# EAGLE design MethaneFlux (EAGLE 9.6.2)

## Sheet 1 of 2: Board 1- Power Module, Arduino MRK NB 1500, Methane Sensors (2600 2602 2611)
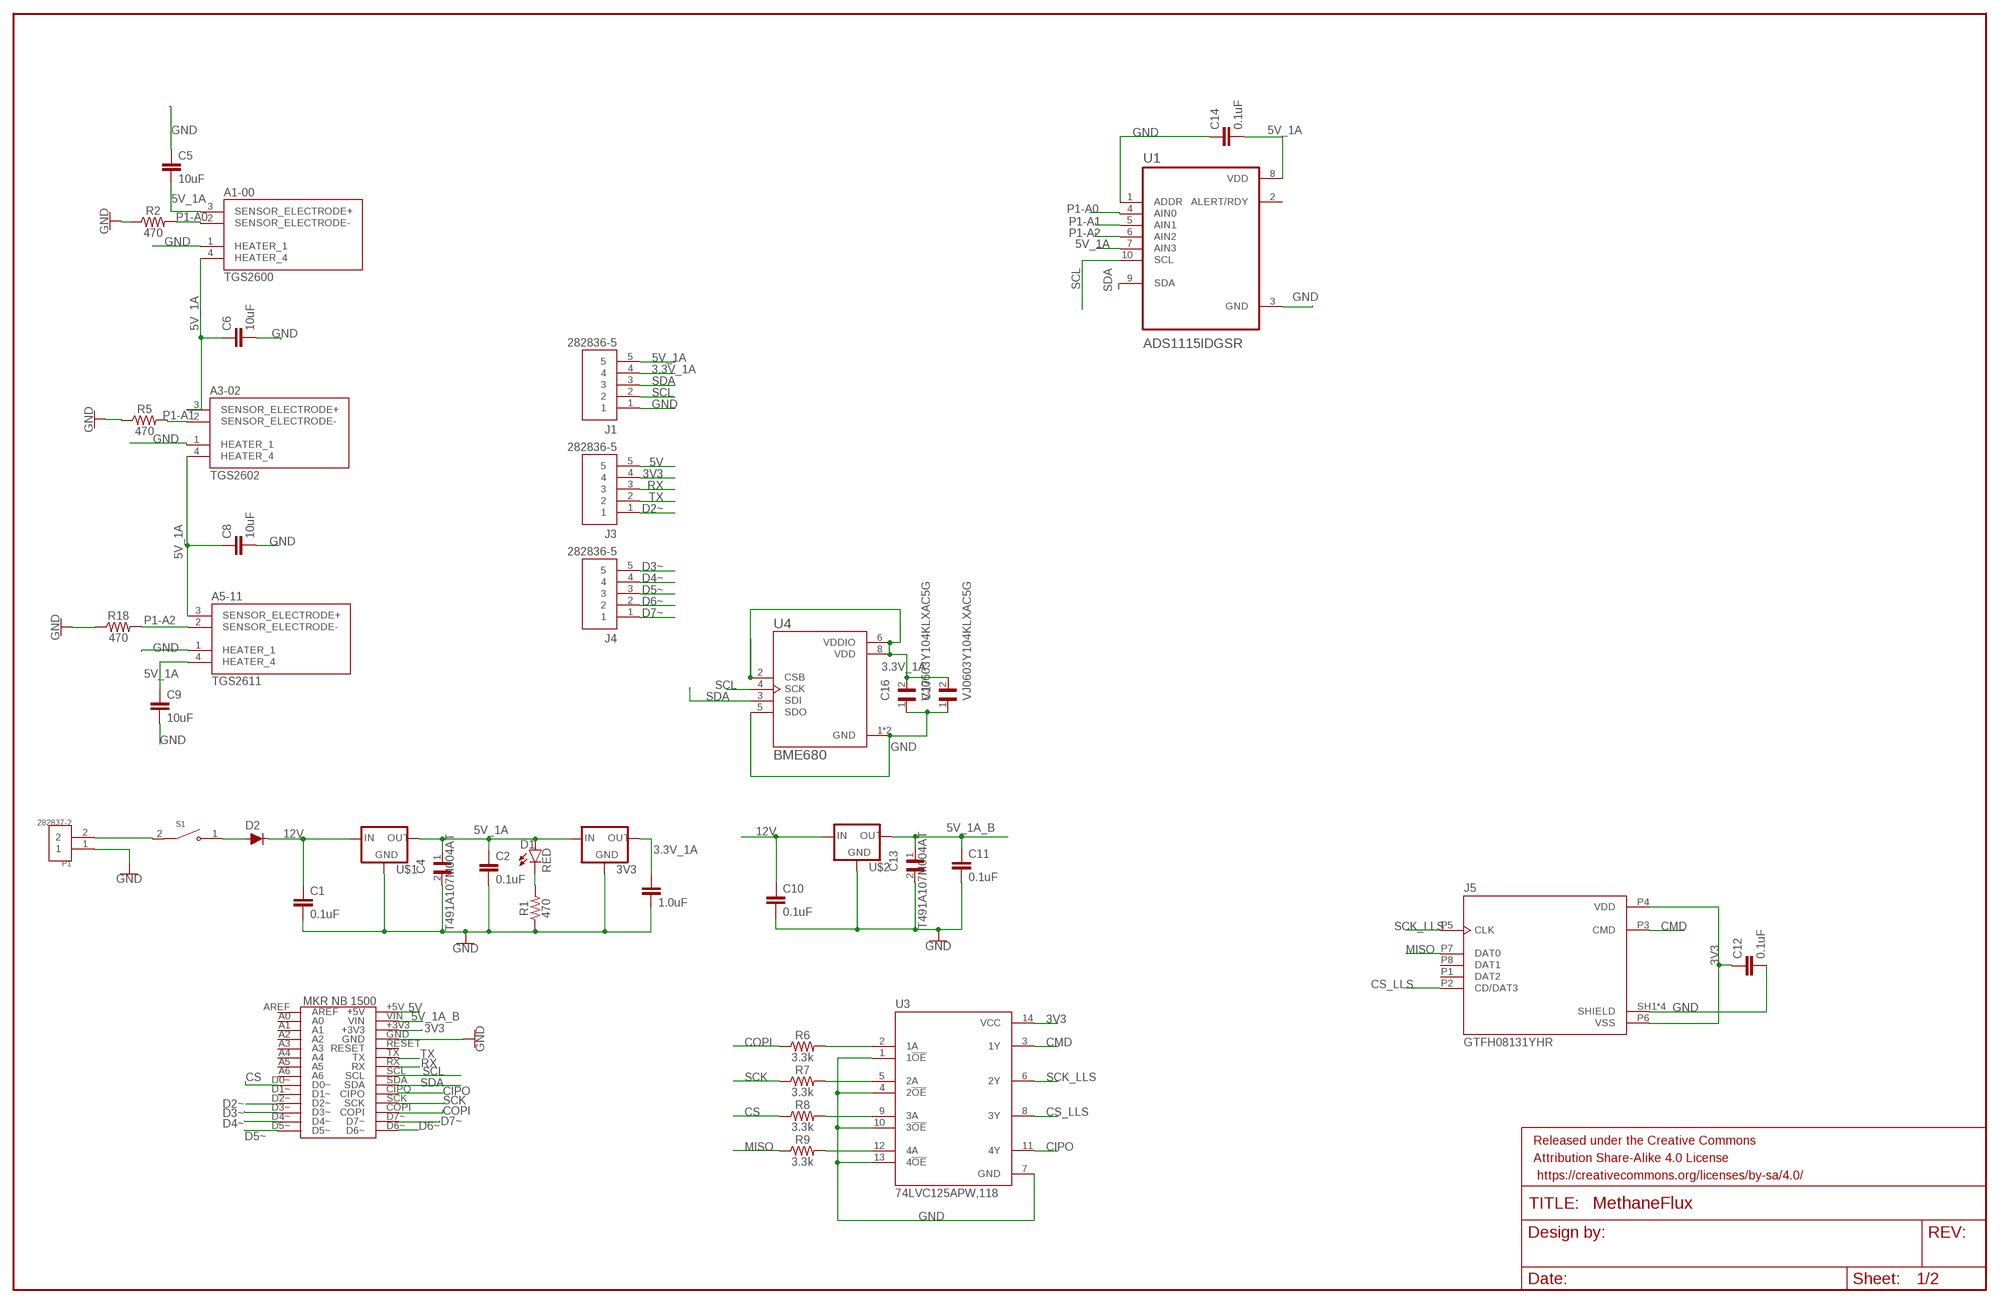
[diagram p0: schematic, sheet 1]

### Parts
3V3  V_REG_LD1117VXXLD1117-SMD  [SOT223]
A1-00  TGS2600  [TO255P920H830-4]
A3-02  TGS2602  [TGS2602]
A5-11  TGS2611  [TGS2611]
C1  0.1uF  0.1UF-0603-25V-5%  [0603]
C2  0.1uF  0.1UF-0603-25V-5%  [0603]
C3  1.0uF  1.0UF-0603-16V-10%  [0603]
C4  T491A107M004AT  [CAPC3216X110N]
C5  10uF  10UF-0603-6.3V-20%  [0603]
C6  10uF  10UF-0603-6.3V-20%  [0603]
C8  10uF  10UF-0603-6.3V-20%  [0603]
C9  10uF  10UF-0603-6.3V-20%  [0603]
C10  0.1uF  0.1UF-0603-25V-5%  [0603]
C11  0.1uF  0.1UF-0603-25V-5%  [0603]
C12  0.1uF  0.1UF-0603-25V-5%  [0603]
C13  T491A107M004AT  [CAPC3216X110N]
C14  0.1uF  0.1UF-0603-25V-5%  [0603]
C16  VJ0603Y104KLXAC5G  [CAPC1608X92N]
C17  VJ0603Y104KLXAC5G  [CAPC1608X92N]
D1  RED  LED-RED0603  [LED-0603]
D2  200mA/100V/1V  DIODE-1N4148  [DIODE-1N4148]
FRAME1  FRAME-LEDGER  [CREATIVE_COMMONS]
J1  282836-5  [TE_282836-5]
J3  282836-5  [TE_282836-5]
J4  282836-5  [TE_282836-5]
J5  GTFH08131YHR  [AMPHENOL_GTFH08131YHR]
P1  282837-2  [TE_282837-2]
R1  470  470OHM-0603-1/10W-1%  [0603]
R2  470  470OHM-0603-1/10W-1%  [0603]
R5  470  470OHM-0603-1/10W-1%  [0603]
R6  3.3k  3.3KOHM-0603-1/10W-1%  [0603]
R7  3.3k  3.3KOHM-0603-1/10W-1%  [0603]
R8  3.3k  3.3KOHM-0603-1/10W-1%  [0603]
R9  3.3k  3.3KOHM-0603-1/10W-1%  [0603]
R18  470  470OHM-0603-1/10W-1%  [0603]
S1  RB141C1100  [SW_RB141C1100]
U1  ADS1115IDGSR  [SOP50P490X110-10N]
U3  74LVC125APW,118  [IC_74LVC125APW,118]
U4  BME680  [PSON80P300X300X100-8N]
U$1  V_REG_LD1117VXXLD1117-SMD  [SOT223]
U$2  V_REG_LD1117VXXLD1117-SMD  [SOT223]
U$5  MKRNB1500  [MRKNB1500]

### Nets
3.3V_1A [5$3v3_1A]: 3V3.2(OUT) C3.1 C16.2 C17.2 J1.4 U4.2(CSB) U4.6(VDDIO) U4.8(VDD)
3V3: C12.1 J3.4 J5.P4(VDD) J5.P6(VSS) U3.14(VCC) U$5.+3V3
5V: J3.5 U$5.+5V
5V_1A [5$3v3_1A]: 3V3.3(IN) A1-00.3(SENSOR_ELECTRODE+) A1-00.4(HEATER_4) A3-02.3(SENSOR_ELECTRODE+) A3-02.4(HEATER_4) A5-11.3(SENSOR_ELECTRODE+) A5-11.4(HEATER_4) C2.1 C4.1 C5.2 C6.1 C8.1 C9.1 C14.2 D1.A J1.5 U1.7(AIN3) U1.8(VDD) U$1.2(OUT)
5V_1A_B [5$3v3_1A]: C11.1 C13.1 U$2.2(OUT) U$5.VIN
12V [PowerIn]: C1.1 C10.1 D2.C U$1.3(IN) U$2.3(IN)
CIPO: U3.11(4Y) U$5.CIPO
CMD: J5.P3(CMD) U3.3(1Y)
COPI: R6.1 U$5.COPI
CS: R8.1 U$5.D0~
CS_LLS: J5.P2(CD/DAT3) U3.8(3Y)
D2~: J3.1 U$5.D2~
D3~: J4.5 U$5.D3~
D4~: J4.4 U$5.D4~
D5~: J4.3 U$5.D5~
D6~: J4.2 U$5.D6~
D7~: J4.1 U$5.D7~
GND [GND]: 3V3.1(GND) A1-00.1(HEATER_1) A3-02.1(HEATER_1) A5-11.1(HEATER_1) C1.2 C2.2 C3.2 C4.2 C5.1 C6.2 C8.2 C9.2 C10.2 C11.2 C12.2 C13.2 C14.1 C16.1 C17.1 J1.1 J5.SH1(SHIELD) J5.SH2(SHIELD) J5.SH3(SHIELD) J5.SH4(SHIELD) P1.1 R1.1 R2.1 R5.1 R18.1 U1.1(ADDR) U1.3(GND) U3.1(1!OE) U3.4(2!OE) U3.7(GND) U3.10(3!OE) U3.13(4!OE) U4.1(GND) U4.5(SDO) U4.7(GND) U$1.1(GND) U$2.1(GND) U$5.GND
MISO: J5.P7(DAT0) R9.1
N$1: R6.2 U3.2(1A)
N$2 [PowerIn]: D1.C R1.2
N$3: R7.2 U3.5(2A)
N$4 [PowerIn]: P1.2 S1.2
N$5: D2.A S1.1
N$6: R8.2 U3.9(3A)
N$7: R9.2 U3.12(4A)
P1-A0 [ADC]: A1-00.2(SENSOR_ELECTRODE-) R2.2 U1.4(AIN0)
P1-A1 [ADC]: A3-02.2(SENSOR_ELECTRODE-) R5.2 U1.5(AIN1)
P1-A2 [ADC]: A5-11.2(SENSOR_ELECTRODE-) R18.2 U1.6(AIN2)
RX: J3.3 U$5.RX
SCK: R7.1 U$5.SCK
SCK_LLS: J5.P5(CLK) U3.6(2Y)
SCL: J1.2 U1.10(SCL) U4.4(SCK) U$5.SCL
SDA: J1.3 U1.9(SDA) U4.3(SDI) U$5.SDA
TX: J3.2 U$5.TX
Unconnected: J5.P1(DAT2) J5.P8(DAT1) U1.2(ALERT/RDY) U$5.A0 U$5.A1 U$5.A2 U$5.A3 U$5.A4 U$5.A5 U$5.A6 U$5.AREF U$5.D1~ U$5.RESET

## Sheet 2 of 2: Breakoff part to board 1- Methane Sensors (2600 2602 2611) and the ADC & BME
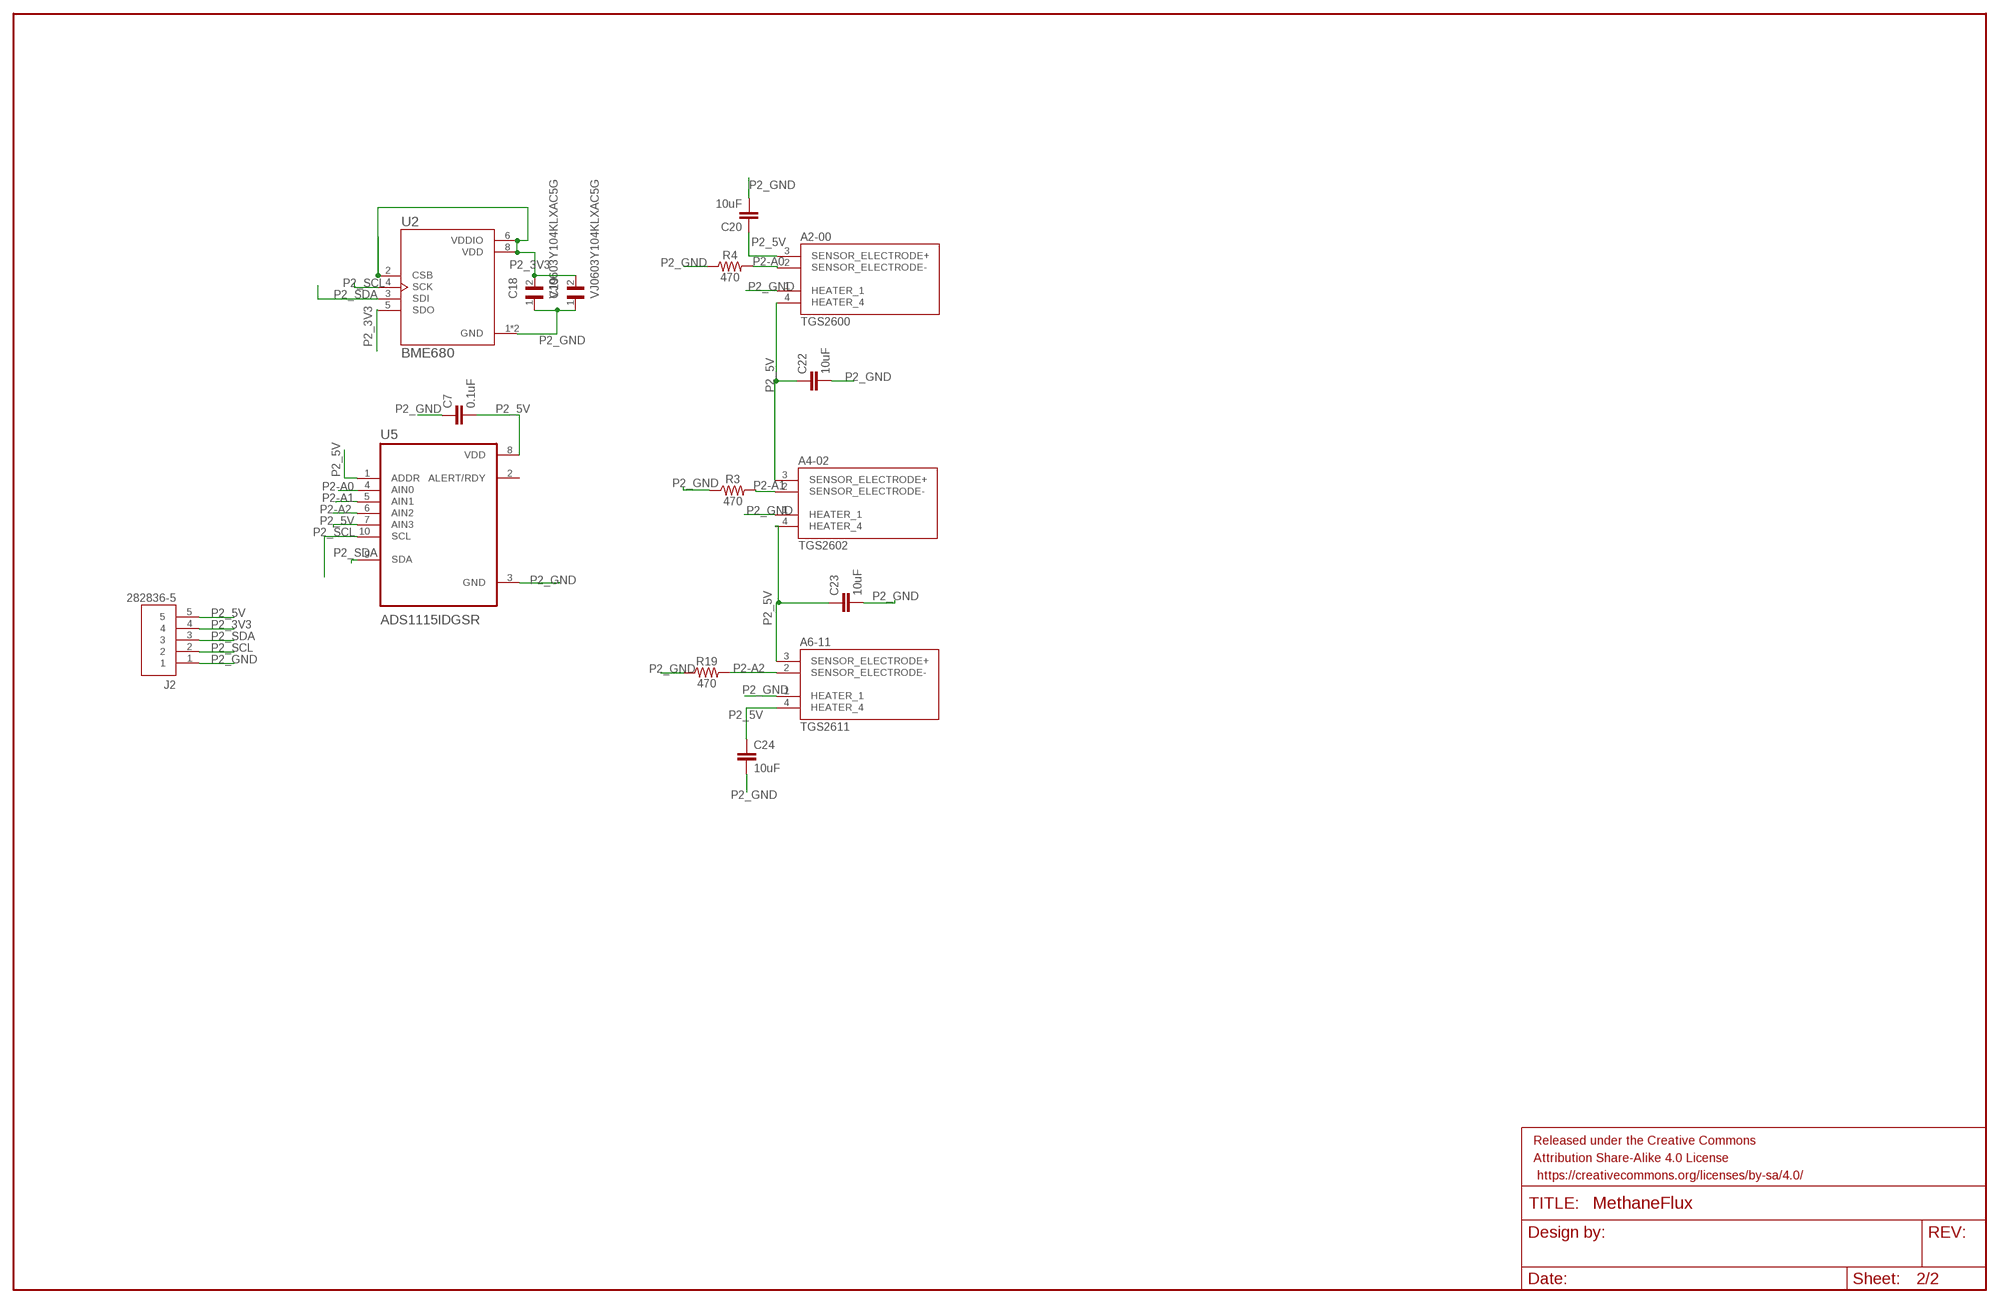
[diagram p1: schematic, sheet 2]

### Parts
A2-00  TGS2600  [TO255P920H830-4]
A4-02  TGS2602  [TGS2602]
A6-11  TGS2611  [TGS2611]
C7  0.1uF  0.1UF-0603-25V-5%  [0603]
C18  VJ0603Y104KLXAC5G  [CAPC1608X92N]
C19  VJ0603Y104KLXAC5G  [CAPC1608X92N]
C20  10uF  10UF-0603-6.3V-20%  [0603]
C22  10uF  10UF-0603-6.3V-20%  [0603]
C23  10uF  10UF-0603-6.3V-20%  [0603]
C24  10uF  10UF-0603-6.3V-20%  [0603]
FRAME2  FRAME-LEDGER  [CREATIVE_COMMONS]
J2  282836-5  [TE_282836-5]
R3  470  470OHM-0603-1/10W-1%  [0603]
R4  470  470OHM-0603-1/10W-1%  [0603]
R19  470  470OHM-0603-1/10W-1%  [0603]
U2  BME680  [PSON80P300X300X100-8N]
U5  ADS1115IDGSR  [SOP50P490X110-10N]

### Nets
P2-A0 [ADC]: A2-00.2(SENSOR_ELECTRODE-) R4.2 U5.4(AIN0)
P2-A1 [ADC]: A4-02.2(SENSOR_ELECTRODE-) R3.2 U5.5(AIN1)
P2-A2 [ADC]: A6-11.2(SENSOR_ELECTRODE-) R19.2 U5.6(AIN2)
P2_3V3 [5$3v3_1A]: C18.2 C19.2 J2.4 U2.2(CSB) U2.5(SDO) U2.6(VDDIO) U2.8(VDD)
P2_5V [5$3v3_1A]: A2-00.3(SENSOR_ELECTRODE+) A2-00.4(HEATER_4) A4-02.3(SENSOR_ELECTRODE+) A4-02.4(HEATER_4) A6-11.3(SENSOR_ELECTRODE+) A6-11.4(HEATER_4) C7.2 C20.1 C22.1 C23.1 C24.1 J2.5 U5.1(ADDR) U5.7(AIN3) U5.8(VDD)
P2_GND [P2_GND]: A2-00.1(HEATER_1) A4-02.1(HEATER_1) A6-11.1(HEATER_1) C7.1 C18.1 C19.1 C20.2 C22.2 C23.2 C24.2 J2.1 R3.1 R4.1 R19.1 U2.1(GND) U2.7(GND) U5.3(GND)
P2_SCL: J2.2 U2.4(SCK) U5.10(SCL)
P2_SDA: J2.3 U2.3(SDI) U5.9(SDA)
Unconnected: U5.2(ALERT/RDY)

## Library data of the parts
3V3 U$1 U$2 = SparkFun-IC-Power:V_REG_LD1117VXX: LD1117VXX voltage regulator. We carry the 3.3V version (COM-00526) in TO-220 package.; PROD_ID: VREG-13917
A1-00 A2-00 = TGS2600:TGS2600: Check availability <https://pricing.snapeda.com/parts/TGS2600/Figaro/view-part?ref=eda>; AVAILABILITY: In Stock; CHECK_PRICES: https://www.snapeda.com/parts/TGS2600/Figaro/view-part/?ref=eda; DESCRIPTION: Gas sensor [Figaro] TGS2600 Gas sensor; MF: Figaro; MP: TGS2600; PACKAGE: None; PRICE: None; SNAPEDA_LINK: https://www.snapeda.com/parts/TGS2600/Figaro/view-part/?ref=snap
A3-02 A4-02 = TGS2600:TGS2602
A5-11 A6-11 = TGS2600:TGS2611
C1 C2 C7 C10-C12 C14 = SparkFun-Capacitors:0.1UF: 0.1µF ceramic capacitors A capacitor is a passive two-terminal electrical component used to store electrical energy temporarily in an electric field.; PROD_ID: CAP-08604
C3 = SparkFun-Capacitors:1.0UF: 1µF ceramic capacitors A capacitor is a passive two-terminal electrical component used to store electrical energy temporarily in an electric field.; PROD_ID: CAP-00868
C4 C13 = T491A107M004AT:T491A107M004AT: Tantalum Capacitor; Capacitor Type:Solid; Capacitance:100µF; Capacitance Tolerance:± 20%; Voltage Rating:4VDC; Capacitor Dielectric Type:Tantalum; Package/Case:3216-18; Termination Type:SMD; ESR:4ohm; Leaded Process Compatible:Yes ;RoHS Compliant: Yes Check availability <https://pricing.snapeda.com/parts/T491A107M004AT/KEMET/view-part?ref=eda>; AVAILABILITY: In Stock; CHECK_PRICES: https://www.snapeda.com/parts/T491A107M004AT/KEMET/view-part/?ref=eda; DESCRIPTION: Capacitors Tantalum PCB 100uF SMD Tol 20% 4 VDC Case Size 3216 T491 Series | KEMET T491A107M004AT; MF: KEMET; MP: T491A107M004AT; PACKAGE: SMD-2 KEMET; PRICE: None; PURCHASE-URL: https://www.snapeda.com/api/url_track_click_mouser/?unipart_id=577514&manufacturer=KEMET&part_name=T491A107M004AT&search_term=t491a107m004at; SNAPEDA_LINK: https://www.snapeda.com/parts/T491A107M004AT/KEMET/view-part/?ref=snap
C5 C6 C8 C9 C20 C22-C24 = SparkFun-Capacitors:10UF: 10.0µF ceramic capacitors A capacitor is a passive two-terminal electrical component used to store electrical energy temporarily in an electric field.; PROD_ID: CAP-11015
C16-C19 = VJ0603Y104KLXAC5G:VJ0603Y104KLXAC5G: Multilayer Ceramic Capacitors MLCC - SMD/SMT 100nF 25volts 10% Check availability <https://pricing.snapeda.com/parts/VJ0603Y104KLXAC5G/Vishay/view-part?ref=eda>; AVAILABILITY: In Stock; CHECK_PRICES: https://www.snapeda.com/parts/VJ0603Y104KLXAC5G/Vishay/view-part/?ref=eda; DESCRIPTION: Multilayer Ceramic Capacitors MLCC - SMD/SMT 100nF 25volts 10%; MF: Vishay; MP: VJ0603Y104KLXAC5G; PACKAGE: 0603 Vishay; PRICE: None; SNAPEDA_LINK: https://www.snapeda.com/parts/VJ0603Y104KLXAC5G/Vishay/view-part/?ref=snap
D1 = SparkFun-LED:LED-RED: Red SMD LED Used in manufacturing of most products at SparkFun Packages: 0603 - SMD 0603 package [Product Link] <http://docs.avagotech.com/docs/AV02-0551EN> 0603 SMART - SMD 0603 SMART package ( more efficient and expensive)[Product Link] <http://www.osram-os.com/Graphics/XPic2/00077099_0.pdf> 1206 - SMD1206 package [Product Link] <https://www.sparkfun.com/datasheets/DevTools/LilyPad/Q150OVS4.pdff> SparkFun Products: Pro Mini 328 -5V <https://www.sparkfun.com/products/821> RedBoard <https://www.sparkfun.com/products/12757> IOIO-OTG <https://www.sparkfun.com/products/13613>; PROD_ID: DIO-00819
D2 = SparkFun-DiscreteSemi:DIODE: Diode These are standard reverse protection diodes and small signal diodes. SparkFun Products: SparkFun SparkPunk Sound Kit <https://www.sparkfun.com/products/11177> SparkFun ESP8266 Thing <https://www.sparkfun.com/products/13231>; PROD_ID: DIO-08378
FRAME1 FRAME2 = SparkFun-Aesthetics:FRAME-LEDGER: Schematic Frame - Ledger Standard 11x14 US Ledger frame
J1-J4 = 282836-5:282836-5: Check availability <https://pricing.snapeda.com/parts/282836-5/TE%20Connectivity/view-part?ref=eda>; AVAILABILITY: In Stock; CHECK_PRICES: https://www.snapeda.com/parts/282836-5/TE+Connectivity+AMP+Connectors/view-part/?ref=eda; COMMENT: 282836-5; DESCRIPTION: 5 Position Wire to Board Terminal Block Horizontal with Board 0.197 (5.00mm) Through Hole; EU_ROHS_COMPLIANCE: Compliant with Exemptions; MF: TE Connectivity; MP: 282836-5; PACKAGE: None; PRICE: None; PURCHASE-URL: https://www.snapeda.com/api/url_track_click_mouser/?unipart_id=417471&manufacturer=TE Connectivity&part_name=282836-5&search_term=282836-5; SNAPEDA_LINK: https://www.snapeda.com/parts/282836-5/TE+Connectivity+AMP+Connectors/view-part/?ref=snap
J5 = GTFH08131YHR:GTFH08131YHR: Check availability <https://pricing.snapeda.com/parts/GTFH08131YHR/Amphenol%20ICC/view-part?ref=eda>; AVAILABILITY: In Stock; CHECK_PRICES: https://www.snapeda.com/parts/GTFH08131YHR/Amphenol+FCI/view-part/?ref=eda; DESCRIPTION: Micro SD and SD Card Sockets, Input Output Connectors, Micro SD Socket, 8 Position, Hinge Type Right Angle SMT, LCP Black; MF: Amphenol ICC; MP: GTFH08131YHR; PACKAGE: None; PRICE: None; PURCHASE-URL: https://www.snapeda.com/api/url_track_click_mouser/?unipart_id=3603870&manufacturer=Amphenol ICC&part_name=GTFH08131YHR&search_term=micro sd socket; SNAPEDA_LINK: https://www.snapeda.com/parts/GTFH08131YHR/Amphenol+FCI/view-part/?ref=snap
P1 = 282837-2:282837-2: TERM BLOCK 5.08MM 2POS SIDE ENTY Check availability <https://pricing.snapeda.com/parts/282837-2/TE%20Connectivity/view-part?ref=eda>; AVAILABILITY: In Stock; CHECK_PRICES: https://www.snapeda.com/parts/282837-2/TE+Connectivity+AMP+Connectors/view-part/?ref=eda; COMMENT: 282837-2; DESCRIPTION: Terminal Block Connector Wire Receptacle 2 5.08 mm 30-16 AWG Green 13.5 A 250 V | TE Connectivity 282837-2; MF: TE Connectivity; MP: 282837-2; PACKAGE: None; PRICE: None; PURCHASE-URL: https://www.snapeda.com/api/url_track_click_mouser/?unipart_id=2549980&manufacturer=TE Connectivity&part_name=282837-2&search_term=None; SNAPEDA_LINK: https://www.snapeda.com/parts/282837-2/TE+Connectivity+AMP+Connectors/view-part/?ref=snap
R1-R5 R18 R19 = SparkFun-Resistors:470OHM: 470Ω resistor A resistor is a passive two-terminal electrical component that implements electrical resistance as a circuit element. Resistors act to reduce current flow, and, at the same time, act to lower voltage levels within circuits. - Wikipedia; PROD_ID: RES-07869
R6-R9 = SparkFun-Resistors:3.3KOHM: 3.3kΩ resistor A resistor is a passive two-terminal electrical component that implements electrical resistance as a circuit element. Resistors act to reduce current flow, and, at the same time, act to lower voltage levels within circuits. - Wikipedia; PROD_ID: RES-07851
S1 = RB141C1100:RB141C1100: Swicth SPST RB141C1100 Check availability <https://pricing.snapeda.com/parts/RB141C1100/E-Switch/view-part?ref=eda>; AVAILABILITY: In Stock; CHECK_PRICES: https://www.snapeda.com/parts/RB141C1100/E-Switch/view-part/?ref=eda; DESCRIPTION: Rocker Switch, RB1 Series, SPST, ON-OFF, Non-Illum, Black, 15A, 125VAC, QC | E-Switch RB141C1100; MF: E-Switch; MP: RB141C1100; PACKAGE: None; PRICE: None; PURCHASE-URL: https://www.snapeda.com/api/url_track_click_mouser/?unipart_id=4449618&manufacturer=E-Switch&part_name=RB141C1100&search_term=rs-001g-a-bb-4; SNAPEDA_LINK: https://www.snapeda.com/parts/RB141C1100/E-Switch/view-part/?ref=snap
U1 U5 = ADS1115IDGSR:ADS1115IDGSR: Check availability <https://pricing.snapeda.com/parts/ADS1115IDGSR/Texas%20Instruments/view-part?ref=eda>; AVAILABILITY: In Stock; CHECK_PRICES: https://www.snapeda.com/parts/ADS1115IDGSR/Texas+Instruments/view-part/?ref=eda; DESCRIPTION: 16-bit, 860-SPS, 4-channel, delta-sigma ADC with PGA, oscillator, VREF, comparator and I2C; MF: Texas Instruments; MP: ADS1115IDGSR; PACKAGE: VSSOP-10 Texas Instruments; PRICE: None; PURCHASE-URL: https://www.snapeda.com/api/url_track_click_mouser/?unipart_id=45903&manufacturer=Texas Instruments&part_name=ADS1115IDGSR&search_term=ads1115idgsr; SNAPEDA_LINK: https://www.snapeda.com/parts/ADS1115IDGSR/Texas+Instruments/view-part/?ref=snap
U2 U4 = BME680:BME680: Integrated Environmental Unit Check availability <https://pricing.snapeda.com/parts/BME680/Bosch%20Sensortec/view-part?ref=eda>; AVAILABILITY: In Stock; CHECK_PRICES: https://www.snapeda.com/parts/BME680/Bosch+Sensortec/view-part/?ref=eda; DESCRIPTION: Gas, Humidity, Pressure, Temperature Sensor I²C, SPI Output; MF: Bosch Sensortec; MP: BME680; PACKAGE: LGA-8 Bosch Tools; PRICE: None; PURCHASE-URL: https://www.snapeda.com/api/url_track_click_mouser/?unipart_id=947201&manufacturer=Bosch Sensortec&part_name=BME680&search_term=bme680; SNAPEDA_LINK: https://www.snapeda.com/parts/BME680/Bosch+Sensortec/view-part/?ref=snap
U3 = 74LVC125APW_118:74LVC125APW,118: Check availability <https://pricing.snapeda.com/parts/74LVC125APW%2C118/Nexperia%20USA%20Inc./view-part?ref=eda> Check availability <https://pricing.snapeda.com/parts/74LVC125APW%2C118/Nexperia%20USA%20Inc./view-part?ref=eda> Check availability <https://pricing.snapeda.com/parts/74LVC125APW%2C118/Nexperia%20USA%20Inc./view-part?ref=eda>; AVAILABILITY: In Stock; CHECK_PRICES: https://www.snapeda.com/parts/74LVC125APW,118/Nexperia/view-part/?ref=eda; DESCRIPTION: Buffer, Non-Inverting 4 Element 1 Bit per Element 3-State Output 14-TSSOP; MF: Nexperia USA Inc.; MP: 74LVC125APW,118; PACKAGE: TSSOP14-14 Nexperia USA Inc.; PRICE: None; PURCHASE-URL: https://www.snapeda.com/api/url_track_click_mouser/?unipart_id=5248541&manufacturer=Nexperia USA Inc.&part_name=74LVC125APW,118&search_term=74lvc125apw; SNAPEDA_LINK: https://www.snapeda.com/parts/74LVC125APW,118/Nexperia/view-part/?ref=snap
U$5 = MKRNB1500:MKRNB1500: Double check before printing that this layout is right.

## Net classes
0 I2C: width 0.229 mm, clearance 0.003 mm
1 ADC: width 0.305 mm, clearance 0.1 mm
2 PowerIn: width 0.635 mm, clearance 0.003 mm
3 5$3v3_1A: width 0.076 mm, clearance 0.003 mm
4 5V_3A: width 0.165 mm, clearance 0.003 mm
5 GND: width 0.305 mm, clearance 0.003 mm
6 P2_GND: width 0.305 mm, clearance 0.003 mm

## Board
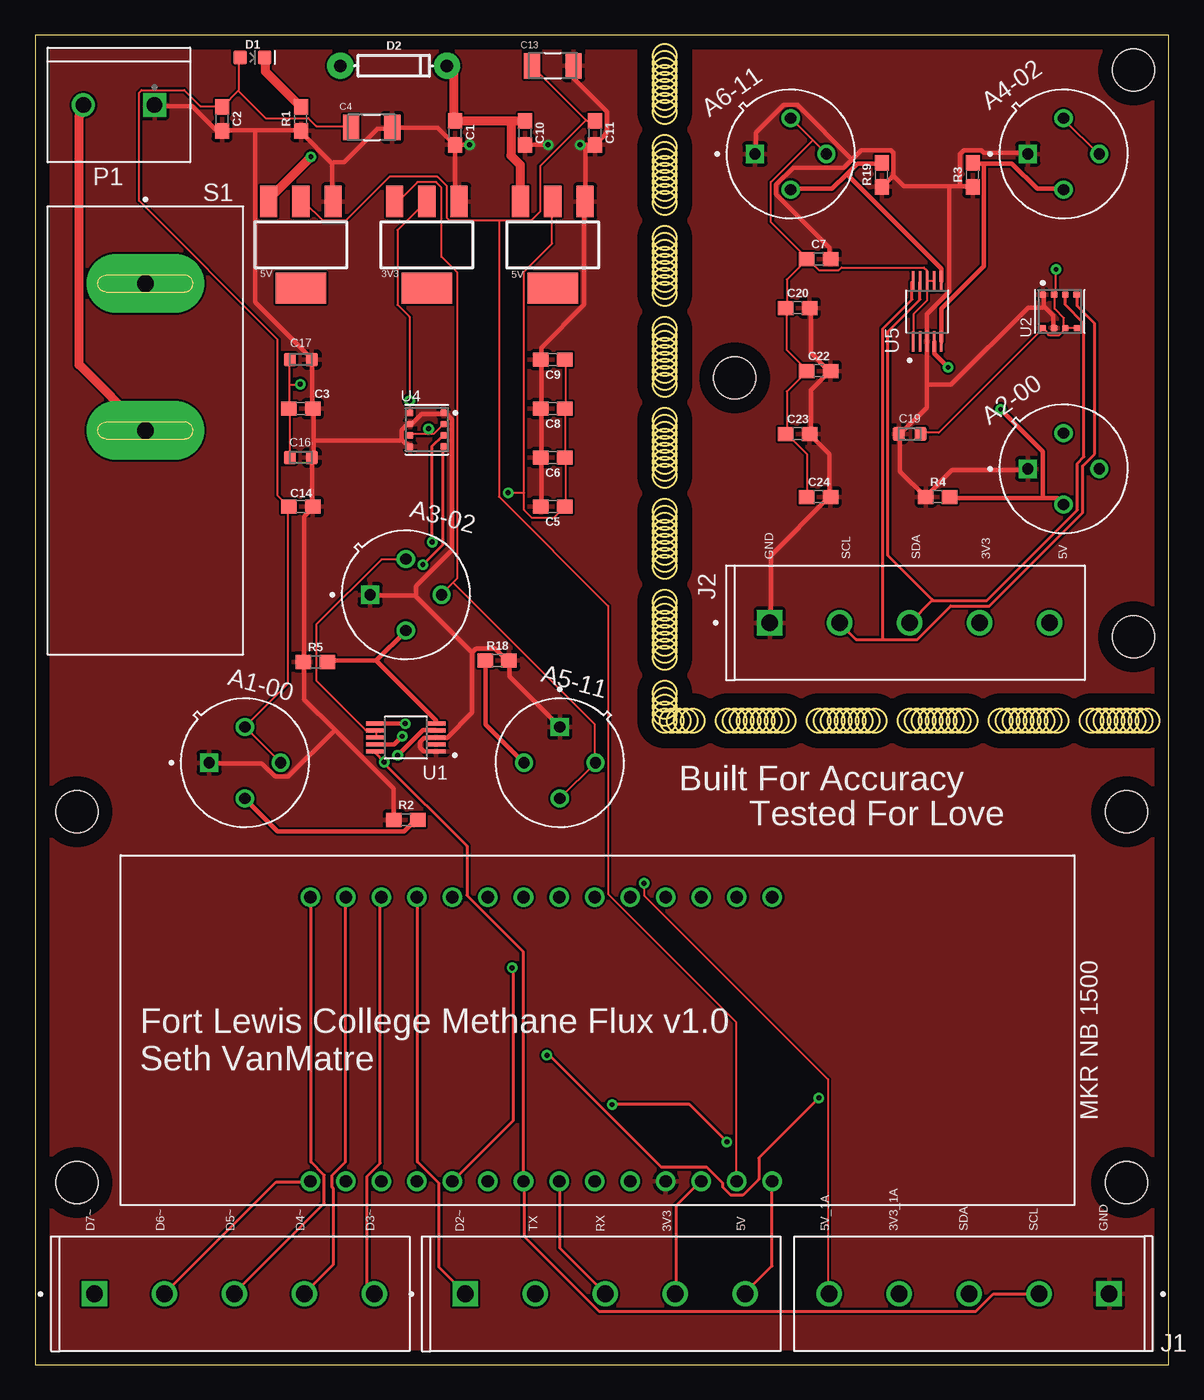
[diagram p2: board, top side]
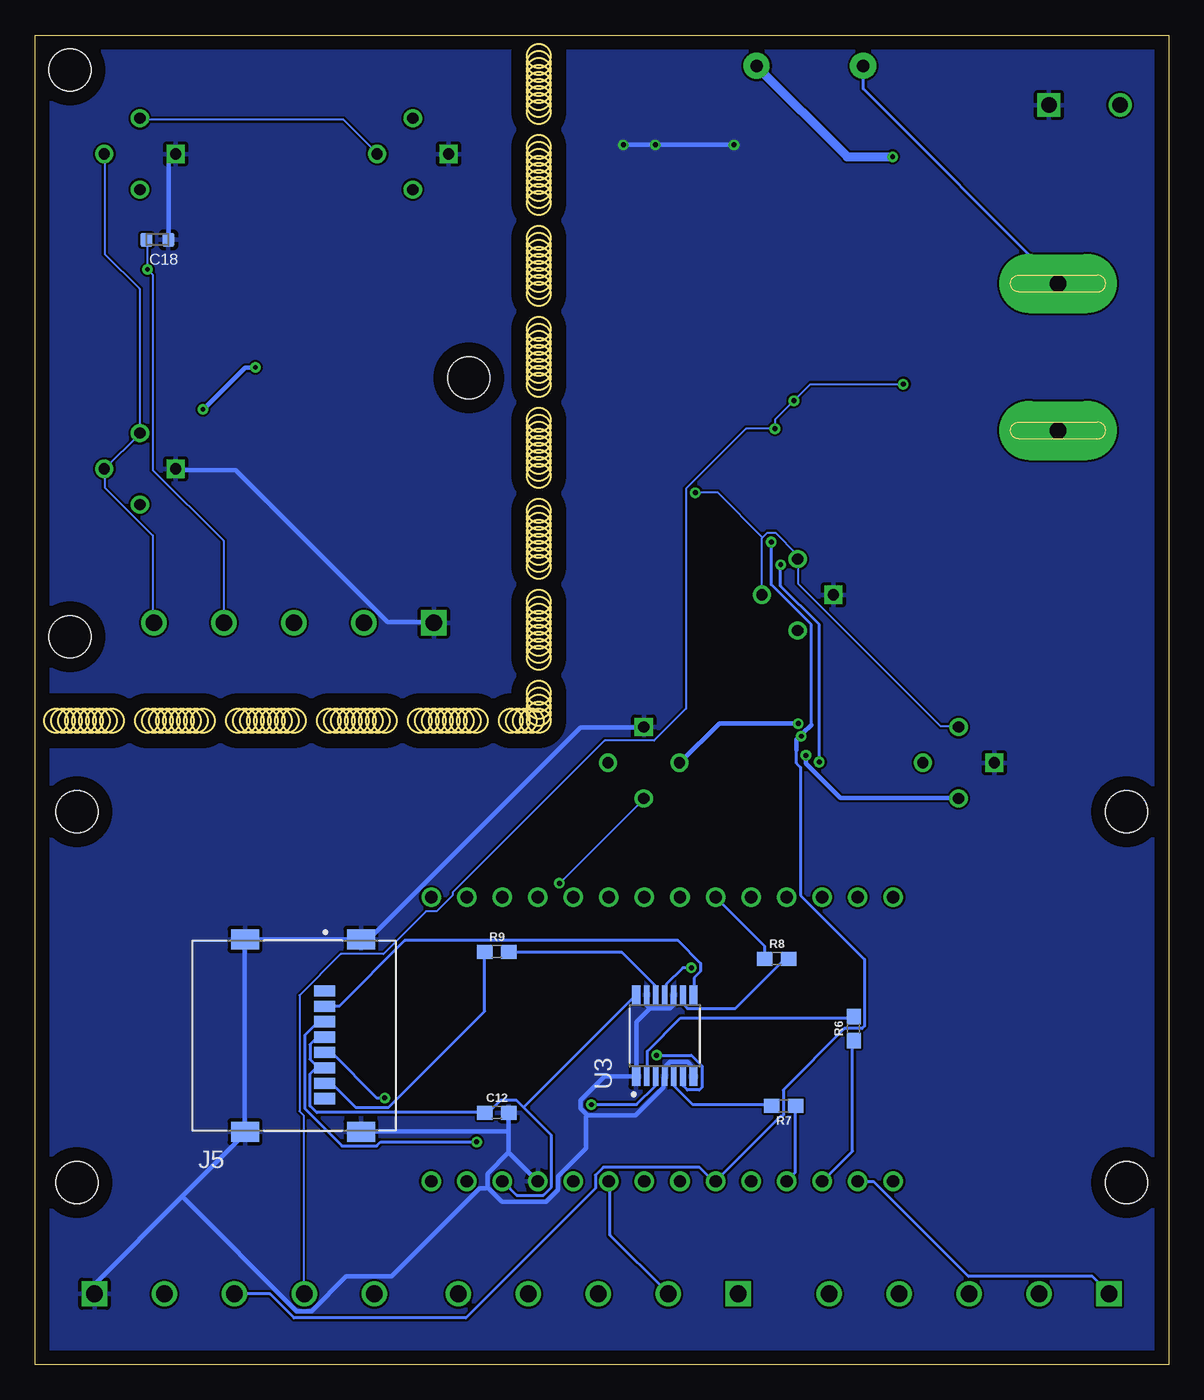
[diagram p3: board, bottom side, seen from below]

Size 81 x 95 mm. Coordinates in mm from the lower left corner, seen from the top.
Outline: 0,0 81,0 81,95 0,95 0,0
Outline: circle at 45,93.5 radius 0.85
Outline: circle at 45,93 radius 0.85
Outline: circle at 45,92.5 radius 0.85
Outline: circle at 45,92 radius 0.85
Outline: circle at 45,91.5 radius 0.85
Outline: circle at 45,91 radius 0.85
Outline: circle at 45,90.5 radius 0.85
Outline: circle at 45,90 radius 0.85
Outline: circle at 45,89.5 radius 0.85
Outline: circle at 45,87 radius 0.85
Outline: circle at 45,86.5 radius 0.85
Outline: circle at 45,86 radius 0.85
Outline: circle at 45,85.5 radius 0.85
Outline: circle at 45,85 radius 0.85
Outline: circle at 45,84.5 radius 0.85
Outline: circle at 45,84 radius 0.85
Outline: circle at 45,83.5 radius 0.85
Outline: circle at 45,83 radius 0.85
Outline: circle at 45,80.5 radius 0.85
Outline: circle at 45,80 radius 0.85
Copper layers (1*16): Top 0.035mm / dielectric 1.5mm / Bottom 0.035mm
Design rules "default *": minimum track width 6mil, minimum drill 0.35mm, track to track 6mil, track to pad 6mil, pad to pad 6mil, via to via 6mil, smd to smd 6mil, copper to edge 40mil, drill to drill 6mil, minimum pad ring 10mil, minimum via ring 8mil, stop-mask expansion 4mil, vias tented up to drill 0mil, thermal gap 10mil
Holes 3 mm at 78.5,52 50,70.5 78.5,92.5 78,39.5 78,13 3,13 3,39.5

### Footprints (pad centres in the part's own frame; a part is rotated, then mirrored left to right if it is on the bottom)
SOT223 = smd 1.219 x 2.235: 1 -2.311,-3.099; 2 0,-3.099; 3 2.311,-3.099 | smd 3.6 x 2.2: 4 0,3.099
TO255P920H830-4 = drill 0.8 square: 1 -2.55,0 | drill 0.8: 2 0,-2.55; 3 2.55,0; 4 0,2.55
TGS2602 = drill 0.8 square: 1 -2.55,0 | drill 0.8: 2 0,-2.55; 3 2.55,0; 4 0,2.55
TGS2611 = drill 0.8 square: 1 -2.55,0 | drill 0.8: 2 0,-2.55; 3 2.55,0; 4 0,2.55
0603 = smd 1.1 x 1: 1 -0.85,0; 2 0.85,0
CAPC3216X110N = smd 1.16 x 1.82: 1 -1.475,0; 2 1.475,0
CAPC1608X92N = smd 0.92 x 0.97: 1 -0.775,0; 2 0.775,0
LED-0603 = smd 1 x 1: A -0.877,0; C 0.877,0
DIODE-1N4148 = drill 0.9 pad 1.88: A -3.81,0; C 3.81,0
TE_282836-5 = drill 1.2 square: 1 -10,0 | drill 1.2: 2 -5,0; 3 0,0; 4 5,0; 5 10,0
AMPHENOL_GTFH08131YHR = smd 0.8 x 1.5: P1 3.2,-2.2; P2 2.1,-2.2; P3 1,-2.2; P4 -0.1,-2.2; P5 -1.2,-2.2; P6 -2.3,-2.2; P7 -3.4,-2.2; P8 -4.5,-2.2 | smd 1.45 x 2: SH1 -6.875,-4.8; SH2 6.875,-4.8; SH3 6.875,3.5; SH4 -6.875,3.5
TE_282837-2 = drill 1.1 square: 1 -2.54,0 | drill 1.1: 2 2.54,0
SW_RB141C1100 = drill 1.2 pad 4.2 long: 1 10.5,0; 2 0,0
SOP50P490X110-10N = smd 1.47 x 0.28: 1 -2.15,1; 2 -2.15,0.5; 3 -2.15,0; 4 -2.15,-0.5; 5 -2.15,-1; 6 2.15,-1; 7 2.15,-0.5; 8 2.15,0; 9 2.15,0.5; 10 2.15,1
PSON80P300X300X100-8N = smd 0.5 x 0.5: 1 1.2,1.2; 2 1.2,0.4; 3 1.2,-0.4; 4 1.2,-1.2; 5 -1.2,-1.22; 6 -1.2,-0.4; 7 -1.2,0.4; 8 -1.2,1.2
IC_74LVC125APW,118 = smd 1.35 x 0.6: 1 -2.925,2.05; 7 -2.925,-2.05; 8 2.925,-2.05; 14 2.925,2.05 | smd 1.35 x 0.4: 2 -2.925,1.3; 3 -2.925,0.65; 4 -2.925,0; 5 -2.925,-0.65; 6 -2.925,-1.3; 9 2.925,-1.3; 10 2.925,-0.65; 11 2.925,0; 12 2.925,0.65; 13 2.925,1.3
MRKNB1500 = drill 0.889: +3V3 5.08,20.3; +5V 0,20.3; A0 2.54,0; A1 5.08,0; A2 7.62,0; A3 10.16,0; A4 12.7,0; A5 15.24,0; A6 17.78,0; AREF 0,0; CIPO 22.86,20.3; COPI 27.94,20.3; D0~ 20.32,0; D1~ 22.86,0; D2~ 25.4,0; D3~ 27.94,0; D4~ 30.48,0; D5~ 33.02,0; D6~ 33.02,20.3; D7~ 30.48,20.3; GND 7.62,20.3; RESET 10.16,20.3; RX 15.24,20.3; SCK 25.4,20.3; SCL 17.78,20.3; SDA 20.32,20.3; TX 12.7,20.3; VIN 2.54,20.3

### Placement (x,y rotation side)
3V3  28,80 180 top
A1-00  15,43 0 top
A2-00  73.5,64 0 top
A3-02  26.5,55 0 top
A4-02  73.5,86.5 0 top
A5-11  37.5,43 270 top
A6-11  54,86.5 0 top
C1  30,88 270 top
C2  13.36,89 270 top
C3  19,68.3 0 top
C4  24.06,88.4 0 top
C5  37,61.3 0 top
C6  37,64.8 180 top
C7  56,79 180 top
C8  37,68.3 180 top
C9  37,71.8 180 top
C10  35,88 270 top
C11  40,88 270 top
C12  48,18 0 bottom
C13  37,92.8 0 top
C14  19,61.3 180 top
C16  19,64.8 180 top
C17  19,71.8 180 top
C18  72.25,80.37 180 bottom
C19  62.5,66.5 0 top
C20  54.5,75.5 0 top
C22  56,71 0 top
C23  54.5,66.5 0 top
C24  56,62 0 top
D1  15.54,93.39 0 top
D2  25.63,92.8 0 top
FRAME1  -77.51,34.96 0 top  (outside the outline)
FRAME2  -76.51,59.85 0 top  (outside the outline)
J1  66.75,5.05 180 top
J2  62.5,53 0 top
J3  40.75,5.05 0 top
J4  14.25,5.05 0 top
J5  62.5,23.5 90 bottom
P1  6,90 180 top
R1  19,89 90 top
R2  26.5,38.92 0 top
R3  67,85 90 top
R4  64.5,62 0 top
R5  20.04,50.2 0 top
R6  22.5,24 90 bottom
R7  27.5,18.5 180 bottom
R8  28,29 0 bottom
R9  48,29.5 0 bottom
R18  33.02,50.3 180 top
R19  60.5,85 90 top
S1  7.89,66.74 90 top
U1  26.5,44.8 180 top
U2  73.22,75.25 90 top
U3  36,23.5 90 bottom
U4  28,66.8 0 top
U5  63.75,75.25 90 top
U$1  37,80 180 top
U$2  19,80 180 top
U$5  52.69,33.39 180 top

### Tracks (layer width: path | path; a pad name or v marks a point on that pad's centre or on a via)
3.3V_1A  (via drill 0.35)
  Top 0.152: C16.2 18.19,64.86 18.19,68.29 C3.1 18.19,68.39 18.19,70 | 18.19,70 18.19,71.72 C17.2 | 28.12,66.48 28.48,66.48 29.15,67.15 U4.2 | 28.12,66.48 26.86,66.48 U4.6 | U4.8 26.77,68.01 v26.77,68.87 26.77,74.87 25.91,75.72 25.91,81.06 27.91,83.06 3V3.2 | v28.12,66.86 28.12,66.48 | v18.95,70.05 18.9,70 18.19,70
  Bottom 0.152: J1.4 61.82,5.14 61.82,17.81 62.1,18.1 62.1,26.38 59.15,29.34 56.1,29.34 53.05,32.38 52.29,32.38 51.15,33.53 51.15,33.72 40.29,44.58 36.77,44.58 34.48,46.86 34.48,62.58 30.19,66.86 v28.12,66.86 28.12,67.51 v26.77,68.87 25.59,70.04 v18.96,70.04 v18.95,70.05
3V3
  Top 0.229: J3.4 45.81,5.14 45.81,11.34 47.53,13.05 U$5.+3V3
  Bottom 0.229: J5.P4 60.39,23.34 60.87,23.34 61.34,22.86 61.34,21.81 60.77,21.24 60.39,21.24 J5.P6 60.87,21.24 61.34,20.77 61.34,18.48 60.87,18 48.96,18 C12.1 48.77,18 48.58,18 47.72,18.86 46.58,18.86 46.1,18.38 | 46.1,18.38 44.1,16.38 44.1,12.67 44.67,12.1 46.58,12.1 47.53,13.05 U$5.+3V3 | 46.1,18.38 38.1,26.38 U3.14
5V
  Top 0.229: U$5.+5V 52.67,13.05 52.67,7.05 50.77,5.14 J3.5
5V_1A  (via drill 0.35)
  Top 0.152: 14.53,91.01 13.43,89.92 C2.1 13.34,89.92 11.81,89.92 10.67,91.06 7.62,91.06 7.43,90.87 7.43,83.15 17.34,73.25 17.34,62.1 18.1,61.34 C14.2 18.1,61.25 18.1,48.67 15.05,45.62 A1-00.4 15.05,45.53 17.53,43.05 A1-00.3 | 14.53,91.01 14.57,91.06 14.57,93.34 D1.A | 14.53,91.01 16.48,89.06 19.53,89.06 20.1,88.49 22.57,88.49 C4.1 | C9.1 37.91,71.72 37.91,68.39 C8.1 37.91,68.29 37.91,64.86 C6.1 37.91,64.77 37.91,61.34 C5.2 37.81,61.25 37.05,60.48 35.53,60.48 34.96,61.05 34.96,62.29 | 34.96,62.29 34.96,78.11 36.96,80.11 36.96,83.06 U$1.2 | U1.8 24.38,44.86 24.38,45.24 U1.7 24.29,45.34 23.62,45.34 20.1,48.86 20.1,52.86 24.77,57.53 26.48,57.53 A3-02.4 | 29.86,55.86 29.05,55.05 A3-02.3 | 29.86,55.86 30.19,56.2 30.19,78.01 29.05,79.15 29.05,84.11 28.67,84.49 27.34,84.49 26,83.15 25.72,83.15 3V3.3 | v33.81,62.29 34.96,62.29 | A5-11.3 37.53,40.48 40.01,42.96 A5-11.4 40.01,43.05 40.01,45.72 29.86,55.86 | v43.53,34.38 43.53,33.53 56.67,20.38 56.67,5.14 J1.5
  Bottom 0.152: 29,59.1 29.05,59.05 29.05,55.05 A3-02.3 | 29,59.1 28.67,59.44 28.1,59.44 26.57,57.91 26.57,57.63 A3-02.4 26.48,57.53 26.48,55.82 16.29,45.62 15.05,45.62 A1-00.4 | v33.81,62.29 32.19,62.29 29,59.1 | v43.53,34.38 37.53,40.39 A5-11.3
5V_1A_B
  Top 0.152: 39.39,88.92 35.53,92.77 C13.1 | 39.39,88.92 39.43,88.87 39.91,88.87 C11.1 | 33.15,81.72 35.43,81.72 36.1,82.39 36.1,85.63 39.39,88.92 | 33.15,81.72 29.62,81.72 29.43,81.92 29.43,84.2 28.77,84.87 25.34,84.87 22.19,81.72 20.57,81.72 19.24,83.06 19.05,83.06 U$2.2 | 33.15,81.72 33.15,62.01 40.96,54.2 40.96,33.62 50.1,24.48 50.1,13.14 U$5.VIN
12V  (via drill 0.35)
  Top 0.635: D2.C 29.53,92.77 29.91,92.39 29.91,88.87 C1.1 30.29,88.87 34,88.87 | 34,88.87 34.96,88.87 C10.1 | v19.72,86.3 16.76,83.34 16.76,83.15 U$2.3 | 34,88.87 34,86.39 34.67,85.72 34.67,83.15 U$1.3
  Bottom 0.635: v19.72,86.3 22.95,86.3 29.43,92.77 D2.C
CIPO  (via drill 0.35)
  Top 0.229: U$5.CIPO 29.91,13.14 34.2,17.43 34.2,28.25 v34.1,28.35
  Bottom 0.229: U3.11 35.91,26.48 35.91,27.15 34.71,28.35 v34.1,28.35
CMD  (via drill 0.35)
  Top 0.229: v41.24,18.57 46.77,18.57 v49.44,15.91
  Bottom 0.229: v41.24,18.57 38.01,18.57 36.67,19.91 36.67,20.57 U3.3 | v49.44,15.91 56.29,15.91 56.58,15.62 59.05,15.62 61.72,18.29 61.72,23.53 60.77,24.48 60.39,24.48 J5.P3
COPI
  Bottom 0.229: R6.1 22.57,23.15 22.57,15.24 24.67,13.14 U$5.COPI
CS
  Bottom 0.229: R8.1 28.86,29.05 28.86,29.91 32.29,33.34 U$5.D0~
CS_LLS
  Bottom 0.229: U3.8 33.91,26.48 33.91,27.62 33.43,28.1 33.43,28.67 35.05,30.29 54.58,30.29 59.27,25.6 J5.P2
D2~
  Top 0.229: U$5.D2~ 27.34,33.34 27.34,14.48 28.86,12.95 28.86,6.95 30.67,5.14 J3.1
D3~
  Top 0.229: U$5.D3~ 24.67,33.34 24.67,14.38 23.72,13.43 23.72,5.62 24.19,5.14 J4.5
D4~
  Top 0.229: U$5.D4~ 22.19,33.34 22.19,14.48 21.24,13.53 21.24,12.67 21.34,12.57 21.34,7.14 19.34,5.14 J4.4
D5~
  Top 0.229: U$5.D5~ 19.72,33.34 19.72,14.48 20.67,13.53 20.67,11.53 14.29,5.14 J4.3
D6~
  Top 0.229: U$5.D6~ 19.62,13.05 17.24,13.05 9.34,5.14 J4.2
D7~
  Bottom 0.229: U$5.D7~ 22.19,13.05 21.05,13.05 14.29,6.29 5.43,6.29 4.29,5.14 J4.1
GND  (via drill 0.35)
  Top 0.305: C5.1 36.2,61.34 36.2,64.77 C6.2 36.2,64.86 36.2,68.2 C8.2 36.2,68.39 36.2,71.72 C9.2 36.2,71.91 36.2,72.68 39.24,75.72 39.24,82.96 U$1.1 39.34,83.15 39.34,87.15 | v36.67,87.15 35.05,87.15 C10.2 | 39.34,87.15 39.91,87.15 C11.2 40.1,87.25 40.86,88.01 40.86,89.53 38.48,91.92 38.48,92.77 C13.2 | 39.34,87.15 v38.96,87.15 | C1.2 30,87.06 30,83.44 30.29,83.15 3V3.1 | C1.2 29.91,87.25 28.77,88.39 25.62,88.39 C4.2 25.43,88.3 24.48,88.3 22.1,85.92 21.34,85.92 21.24,85.82 | 15.72,88.2 18.95,88.2 R1.1 19.05,88.01 21.24,85.82 | 15.72,88.2 13.43,88.2 C2.2 13.24,88.2 12.95,88.2 11.24,89.92 8.57,89.92 P1.1 | 21.24,85.82 21.24,83.15 U$2.1 | U1.1 28.57,43.81 27.81,43.81 27.53,44.1 27.53,44.48 27.81,44.77 28.57,44.77 U1.3 28.77,44.77 29.43,44.77 31.24,46.58 31.24,50.86 | A5-11.1 37.43,45.62 33.91,49.15 33.91,50.29 R18.1 33.72,50.29 32.86,51.15 31.53,51.15 31.24,50.86 | 27.15,54.96 24,54.96 A3-02.1 | 31.24,50.86 27.15,54.96 | 26.19,66.1 26.48,65.82 26.57,65.82 26.77,65.63 U4.5 | 26.19,66.1 26.19,66.77 26.57,67.15 26.77,67.15 U4.7 26.86,67.15 27.62,67.91 29.15,67.91 U4.1 29.34,68.01 29.81,67.53 29.81,58.2 27.24,55.63 27.24,55.05 27.15,54.96 | 21.43,45.34 19.24,47.53 19.24,50.1 R5.1 19.24,50.29 19.24,60.58 19.81,61.15 C14.1 19.81,61.34 19.81,64.77 C16.1 19.91,64.86 19.91,66.01 | 21.43,45.34 25.62,41.15 25.62,38.96 R2.1 | 19.91,66.01 19.91,68.2 C3.2 19.81,68.39 19.81,71.72 C17.1 19.72,71.91 15.72,75.91 15.72,88.2 | 19.91,66.01 26.1,66.01 26.19,66.1 | 21.43,45.34 18.1,42.01 17.14,42.01 16.19,42.96 12.48,42.96 A1-00.1 | v31.05,87.15 30.1,87.15 C1.2
  Bottom 0.305: U3.7 34,20.67 34,21.24 34.38,21.62 35.62,21.62 35.91,21.34 35.91,20.67 U3.4 36.1,20.48 36.1,19.81 38.1,17.81 41.53,17.81 | 37.05,25.43 35.62,25.43 35.43,25.62 35.43,26.38 U3.10 | 37.05,25.43 37.24,25.62 37.24,26.38 U3.13 | 37.05,25.43 38.01,24.48 38.01,20.67 U3.1 38.2,20.57 40.29,20.57 42.01,18.86 42.01,18.29 41.53,17.81 | 47.15,15.14 47.15,16.67 | 47.15,16.67 47.15,17.91 C12.2 | 47.15,15.14 45.15,13.14 U$5.GND | 47.15,16.67 57.63,16.67 J5.SH1 | 48.67,12.67 47.62,11.62 44.48,11.62 43.62,12.48 43.62,13.43 41.62,15.43 41.62,17.72 41.53,17.81 | 48.67,12.67 48.67,13.62 47.15,15.14 | 70.48,12 66.01,16.48 J5.SH4 66.01,16.67 66.01,30.29 J5.SH3 65.91,30.39 57.72,30.39 J5.SH2 57.63,30.48 57.05,30.48 42.01,45.53 37.53,45.53 A5-11.1 | 70.48,12 76.68,5.81 76.68,5.14 J1.1 | 70.48,12 62.29,3.81 61.25,3.81 58.77,6.29 55.53,6.29 49.24,12.57 48.77,12.57 48.67,12.67 | v38.96,87.15 v36.67,87.15 v31.05,87.15
  pour Top: 0,95 44,95 44,45.5 44.5,45 81,45 81,0 0,0
  pour Bottom: 0,95 44,95 44,45.5 44.5,45 81,45 81,0 0,0
MISO
  Bottom 0.229: R9.1 48.86,29.43 48.86,25.24 55.72,18.38 58.1,18.38 59.82,20.1 J5.P7
N$1
  Bottom 0.229: R6.2 22.57,24.77 34.86,24.77 37.24,22.38 37.24,20.67 U3.2
N$2
  Top 0.635: D1.C 16.48,93.34 16.48,92.39 18.95,89.92 R1.2
N$3
  Bottom 0.229: R7.2 28.38,18.57 34,18.57 35.34,19.91 35.34,20.57 U3.5
N$4
  Top 0.635: P1.2 3.14,89.14 3.14,71.44 7.81,66.77 S1.2
N$5
  Bottom 0.229: D2.A 21.81,92.77 21.81,91.15 7.91,77.25 S1.1
N$6
  Bottom 0.229: R8.2 27.24,28.96 27.43,28.96 30.96,25.43 34.38,25.43 34.67,25.72 34.67,26.38 U3.9
N$7
  Bottom 0.229: R9.2 47.15,29.43 39.05,29.43 36.67,27.05 36.67,26.48 U3.12
P1-A0  (via drill 0.35)
  Top 0.305: R2.2 27.34,38.86 27.15,38.86 26.38,38.1 17.34,38.1 15.05,40.39 A1-00.2 | v25.91,43.53 27.72,45.34 28.57,45.34 U1.4
  Bottom 0.305: v25.91,43.53 25.91,42.96 23.43,40.48 15.05,40.48 A1-00.2
P1-A1
  Top 0.305: 24.38,50.29 20.95,50.29 R5.2 | 24.38,50.29 26.48,52.39 A3-02.2 | 24.38,50.29 28.67,46.01 28.67,45.81 U1.5
P1-A2  (via drill 0.35)
  Top 0.305: R18.2 32.19,50.29 32.19,45.72 34.86,43.05 A5-11.2 | U1.6 24.38,45.81 24.4,45.8 v26.45,45.8
  Bottom 0.305: A5-11.2 34.86,43.05 32.1,45.81 26.46,45.81 v26.45,45.8
P2-A0  (via drill 0.35)
  Top 0.305: 72,61.91 73.06,61.91 73.44,61.53 A2-00.2 | 72,61.91 65.44,61.91 R4.2 | U5.4 64.25,72.25 v65.25,71.25 | 72,61.91 72,65.25 v69,68.25
  Bottom 0.305: v69,68.25 66,71.25 v65.25,71.25
P2-A1
  Top 0.305: 67.82,85.82 69.82,85.82 71.63,84.01 73.44,84.01 A4-02.2 | 67.82,85.82 67.06,85.82 R3.2 | 67.82,85.82 67.82,78.49 64.77,75.44 64.77,73.15 U5.5
P2-A2
  Top 0.305: 58.01,85.06 56.96,84.01 54.01,84.01 A6-11.2 | 58.01,85.06 58.77,85.82 60.48,85.82 R19.2 | 58.01,85.06 64.77,78.3 64.77,77.44 U5.6
P2_3V3  (via drill 0.35)
  Top 0.152: U2.6 73.63,74.01 73.15,73.53 72.48,73.53 72.3,73.72 72.3,73.82 72.1,74.01 U2.8 72.01,74.01 64.58,66.58 63.34,66.58 C19.2 | U2.5 74.39,74.11 73.63,74.11 U2.6 | U2.6 73.53,74.11 73.53,74.77 72.87,75.44 72.87,76.39 U2.2 72.87,76.49 72.96,76.58 v72.96,78.25
  Bottom 0.152: C18.2 72.96,80.3 v72.96,78.25 72.58,77.87 72.58,63.91 67.53,58.86 67.53,53.05 J2.4
P2_5V
  Top 0.152: A4-02.4 73.53,88.96 76.01,86.49 A4-02.3 | 55.58,87.49 A6-11.4 | 55.58,87.49 56.48,86.58 A6-11.3 | U5.1 62.77,73.15 62.77,75.06 63.72,76.01 63.72,77.34 U5.8 | U5.7 64.2,77.44 63.82,77.44 U5.8 | C7.2 55.15,78.96 53.72,77.53 53.72,75.53 C20.1 53.72,75.44 53.72,72.48 55.15,71.06 C22.1 55.15,70.96 53.72,69.53 53.72,66.58 C23.1 53.72,66.48 55.15,65.06 C24.1 | U5.8 63.72,77.44 63.72,78.2 63.53,78.39 57.63,78.39 57.44,78.2 56.01,78.2 55.24,78.96 C7.2 | 55.58,87.49 52.58,84.49 52.58,81.63 55.15,79.06 C7.2
  Bottom 0.152: J2.5 72.58,53.05 72.58,59.24 76.01,62.67 76.01,63.91 A2-00.3 76.01,64.01 73.53,66.48 A2-00.4 73.53,66.58 73.53,76.87 76.01,79.34 76.01,86.49 A4-02.3 | A4-02.4 73.44,88.96 58.96,88.96 56.58,86.58 A6-11.3
P2_GND
  Top 0.305: C20.2 55.44,75.44 55.44,72.3 56.67,71.06 C22.2 56.77,70.96 55.44,69.63 55.44,66.58 C23.2 55.44,66.39 56.77,65.06 56.77,62.01 C24.2 56.67,61.91 52.58,57.82 52.58,53.05 J2.1 | 72.1,75.63 72.77,74.96 72.77,74.11 U2.7 | 72.1,75.63 72.1,76.39 U2.1 | 63.72,70.01 63.72,68.39 61.91,66.58 C19.1 61.82,66.48 61.82,63.82 63.63,62.01 R4.1 63.72,62.1 65.53,63.91 70.87,63.91 A2-00.1 | 63.72,70.01 63.72,73.06 U5.3 63.72,73.25 63.72,75.06 65.34,76.68 65.34,84.2 | 63.72,70.01 65.46,70.01 70.98,75.53 72.01,75.53 72.1,75.63 | 58.39,86.11 59.05,86.77 61.15,86.77 61.34,86.58 61.34,84.96 | 58.39,86.11 57.82,85.53 54.2,85.53 52.96,84.3 52.96,83.63 56.77,79.82 56.77,79.06 C7.1 | 61.34,84.96 60.58,84.2 R19.1 | 65.34,84.2 62.1,84.2 61.34,84.96 | 65.34,84.2 66.1,84.2 | 66.1,84.2 66.96,84.2 R3.1 | 58.39,86.11 54.48,90.01 53.53,90.01 51.53,88.01 51.53,86.58 A6-11.1 | 66.1,84.2 66.1,86.49 66.39,86.77 67.63,86.77 67.82,86.58 70.87,86.58 A4-02.1
  Bottom 0.305: C18.1 71.44,80.39 71.44,86.01 70.96,86.49 A4-02.1 | J2.1 52.58,53.05 55.82,53.05 66.67,63.91 70.87,63.91 A2-00.1
  pour Bottom: 46,95 46,47 81,47 81,95
  pour Top: 46,95 46,47 81,47 81,95
P2_SCL
  Top 0.229: 60.58,51.82 58.67,51.82 57.53,52.96 J2.2 | 60.58,51.82 63.06,51.82 65.44,54.2 68.2,54.2 74.87,60.87 74.87,64.2 75.72,65.06 75.72,74.39 74.49,75.63 74.49,76.39 U2.4 | 60.58,51.82 60.58,74.01 62.67,76.11 62.67,77.34 U5.10
P2_SDA
  Top 0.229: 64.1,54.58 68.01,54.58 74.49,61.05 74.49,64.39 74.96,64.86 74.96,74.39 73.63,75.72 73.63,76.39 U2.3 | 64.1,54.58 62.58,53.05 J2.3 | U5.9 63.25,77.34 63.25,76.11 60.96,73.82 60.96,57.82 64.1,54.67 64.1,54.58
RX
  Top 0.229: U$5.RX 37.53,13.05 37.53,8.29 40.67,5.14 J3.3
SCK
  Bottom 0.229: R7.1 26.67,18.48 26.67,13.72 27.24,13.14 U$5.SCK
SCK_LLS  (via drill 0.35)
  Top 0.229: v36.58,22.1 36.77,22.1 44.77,14.1 48.01,14.1 49.15,12.95 49.15,12.67 49.72,12.1 50.58,12.1 51.72,13.24 51.72,14.76 v56.01,19.05
  Bottom 0.229: v36.58,22.1 34.1,22.1 33.34,21.34 33.34,19.81 33.53,19.62 34.38,19.62 34.67,19.91 34.67,20.57 U3.6 | v56.01,19.05 56.58,19.05 59.82,22.29 60.29,22.29 J5.P5
SCL  (via drill 0.35)
  Top 0.229: v27.72,57.15 29.15,58.58 29.15,65.53 U4.4 | U1.10 24.29,43.72 v24.96,43.05 24.96,42.96 30.86,37.05 30.86,33.53 34.86,29.53 34.86,13.14 U$5.SCL 34.96,13.05 34.96,9.14 40.29,3.81 67.25,3.81 68.48,5.05 71.72,5.05 J1.2
  Bottom 0.229: v27.72,57.15 27.72,55.63 24.96,52.86 v24.96,43.05
SDA  (via drill 0.35)
  Top 0.229: v28.38,58.77 28.38,65.63 29.15,66.39 U4.3
  Top 0.305: v26.24,44.89 25.65,44.3 U1.9
  Bottom 0.229: v28.38,58.77 28.38,55.72 25.53,52.86 25.53,45.7 | 26.57,43.91 26.57,42.96 26.29,42.67 26.29,33.53 21.72,28.96 21.72,24.19 21.91,24 23.15,24 27.53,19.62 27.53,17.81 27.62,17.72 27.72,17.72 32.29,13.14 U$5.SDA 32.48,13.05 33.53,14.1 40.39,14.1 40.96,13.53 40.96,12.57 50.2,3.33 62.48,3.33 64.2,5.05 66.67,5.05 J1.3
  Bottom 0.305: 26.57,43.91 26.57,44.65 26.11,45.11 | 26.11,45.11 25.53,45.7 | 26.11,45.11 26.11,45.02 v26.24,44.89
TX
  Bottom 0.229: U$5.TX 39.91,13.05 39.91,9.24 35.81,5.14 J3.2

### Text on the board
tNames: 5V | 3V3 | 5V | GND | SCL | SDA | 3V3 | 5V | Built For Accuracy | Tested For Love | Fort Lewis College Methane Flux v1.0 / Seth VanMatre | D7~ | D6~ | D5~ | D4~ | D3~ | D2~ | TX | RX | 3V3 | 5V | 5V_1A | 3V3_1A | SDA | SCL | GND